# EAGLE design I2C_LCD_MCP23017 (EAGLE 7.4.0)
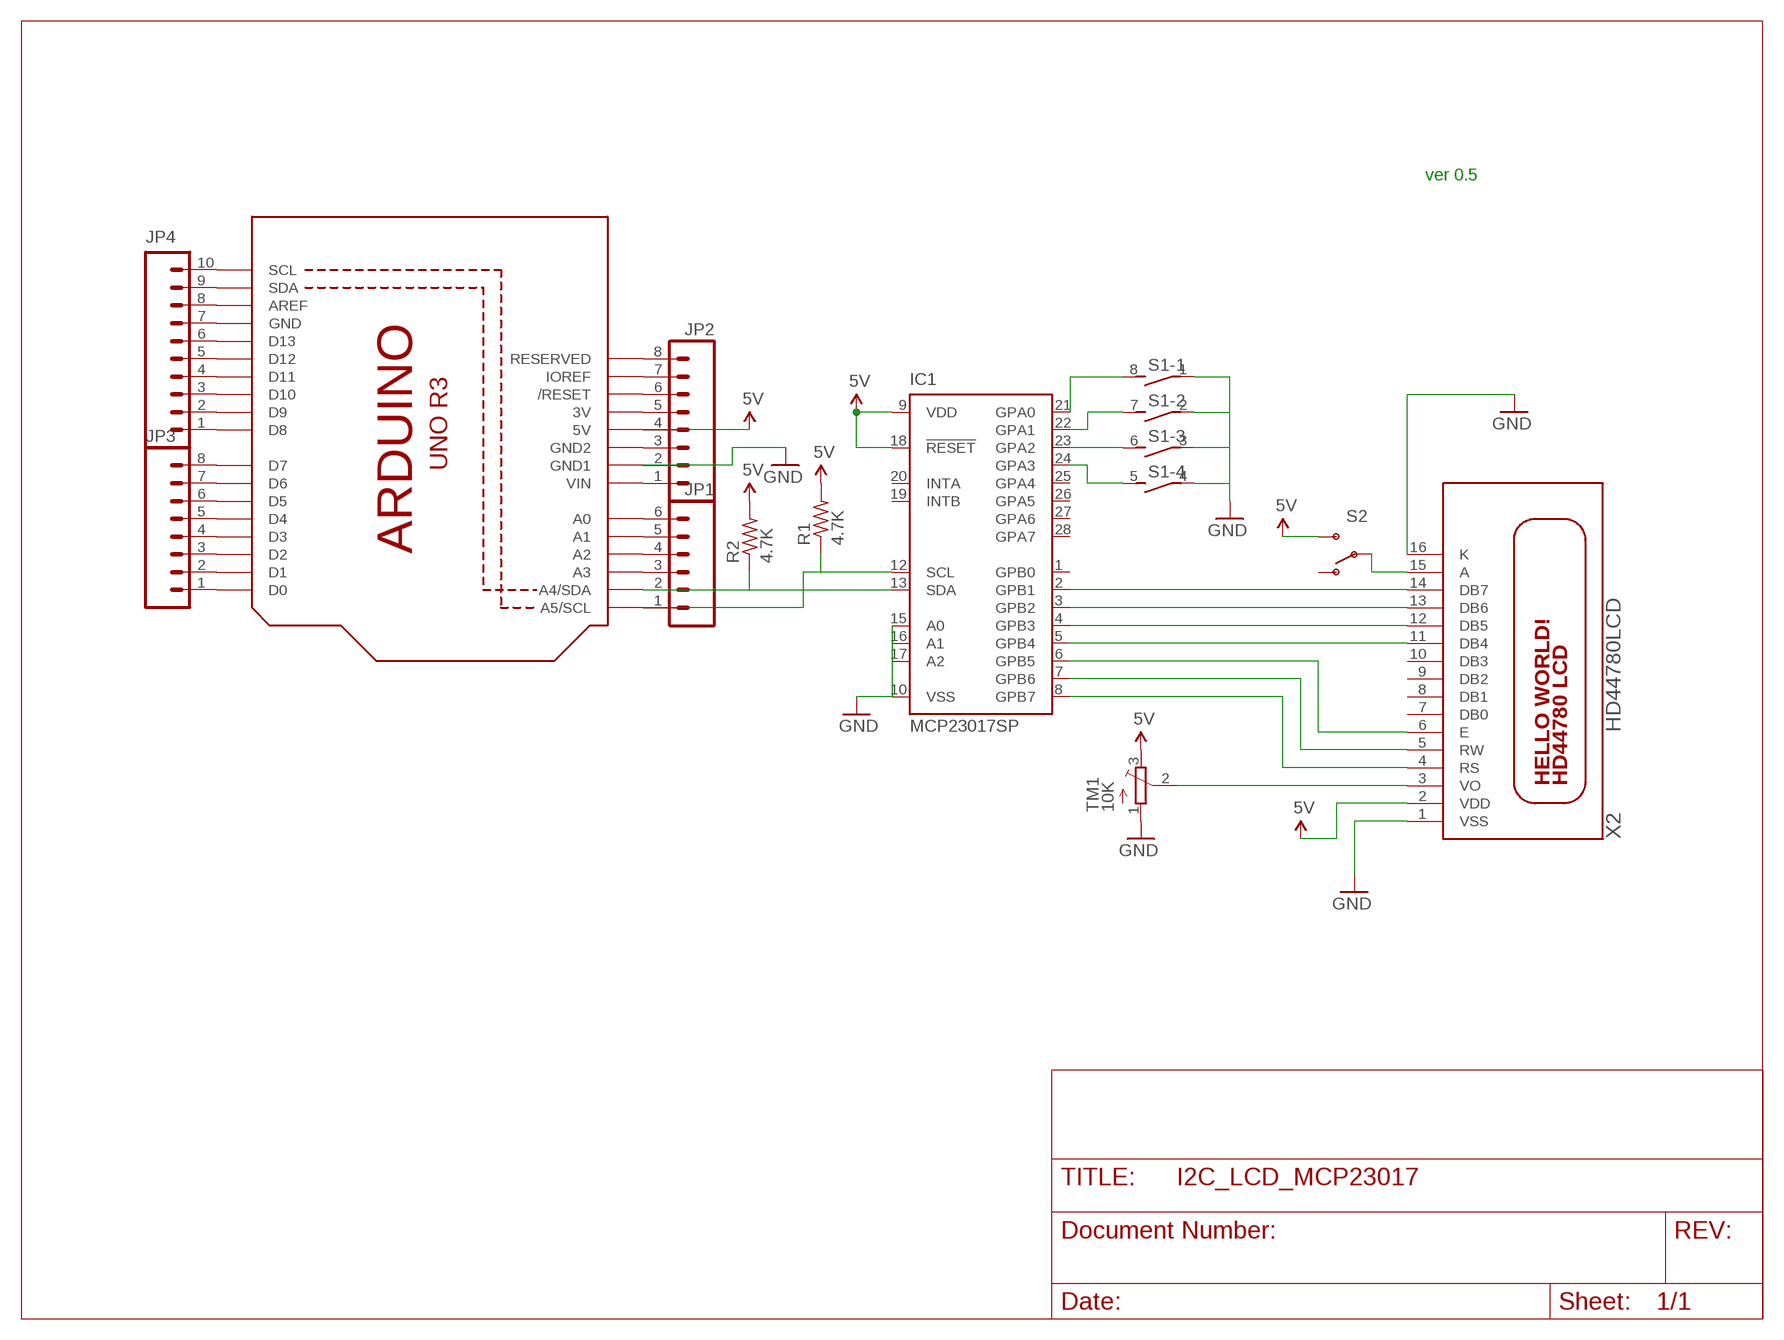
[diagram p0: schematic, sheet 1]

## Parts
IC1  MCP23017SP  [DIL28-3]
JP1  M06LONGPADS  [1X06_LONGPADS]
JP2  M08LONGPADS  [1X08_LONGPADS]
JP3  M08LONGPADS  [1X08_LONGPADS]
JP4  M10LONGPADS  [1X10_LONGPADS]
R1  4.7K  R-US_0207/10  [0207/10]
R2  4.7K  R-US_0207/10  [0207/10]
S1  DIP04S  [DIP04S]
S2  SWITCH-SPDTPTH  [SWITCH-SPDT]
TM1  10K  TRIMPOT  [TRIM-3386U]
U1  ARDUINOR3LONGHEADERATBOTTOM  [ARDUINOR3-BPLACE_TURNED]
X2  HD44780LCD  [LCD_40_04]

## Nets
5V: IC1.9(VDD) IC1.18(!RESET) JP2.4 R1.2 R2.2 S2.3(S) TM1.3(E) U1.5V X2.2(VDD)
GND: IC1.10(VSS) IC1.15(A0) IC1.16(A1) IC1.17(A2) JP2.2 S1.1 S1.2 S1.3 S1.4 TM1.1(A) U1.GND1 X2.1(VSS) X2.16(K)
N$1: JP4.7 U1.GND
N$2: TM1.2(S) X2.3(VO)
N$3: IC1.21(GPA0) S1.8
N$4: IC1.2(GPB1) X2.14(DB7)
N$5: IC1.3(GPB2) X2.13(DB6)
N$6: IC1.4(GPB3) X2.12(DB5)
N$7: IC1.5(GPB4) X2.11(DB4)
N$8: IC1.6(GPB5) X2.6(E)
N$9: IC1.7(GPB6) X2.5(RW)
N$10: IC1.8(GPB7) X2.4(RS)
N$11: IC1.13(SDA) JP1.2 R2.1 U1.A4(A4/SDA)
N$12: IC1.12(SCL) JP1.1 R1.1 U1.A5(A5/SCL)
N$13: JP3.4 U1.D3
N$14: JP1.3 U1.A3
N$15: JP1.4 U1.A2
N$16: JP1.5 U1.A1
N$17: JP1.6 U1.A0
N$18: JP2.1 U1.VIN
N$19: IC1.22(GPA1) S1.7
N$20: JP2.3 U1.GND2
N$21: IC1.23(GPA2) S1.6
N$22: JP2.5 U1.3V
N$23: JP2.6 U1.RESET(/RESET)
N$24: JP2.7 U1.IOREF
N$25: JP2.8 U1.RESERVED
N$26: JP3.1 U1.D0
N$27: JP3.2 U1.D1
N$28: JP3.3 U1.D2
N$29: JP3.5 U1.D4
N$30: JP3.6 U1.D5
N$31: JP3.7 U1.D6
N$32: JP3.8 U1.D7
N$33: JP4.1 U1.D8
N$34: JP4.2 U1.D9
N$35: JP4.3 U1.D10
N$36: JP4.4 U1.D11
N$37: JP4.5 U1.D12
N$38: JP4.6 U1.D13
N$39: IC1.24(GPA3) S1.5
N$40: JP4.8 U1.AREF
N$41: JP4.9 U1.SDA
N$42: JP4.10 U1.SCL
N$43: S2.2(P) X2.15(A)
Unconnected: IC1.1(GPB0) IC1.19(INTB) IC1.20(INTA) IC1.25(GPA4) IC1.26(GPA5) IC1.27(GPA6) IC1.28(GPA7) S2.1(O) X2.7(DB0) X2.8(DB1) X2.9(DB2) X2.10(DB3)

## Notes on the sheet
- ver 0.5

## Library data of the parts
IC1 = adafruit:MCP23017: http://ww1.microchip.com/downloads/en/DeviceDoc/21952a.pdf Source: http://ww1.microchip.com/downloads/en/DeviceDoc/21952a.pdf
JP1 = tmb_connectors:M06: Header 6 Standard 6-pin 0.1" header. Use with straight break away headers (SKU : PRT-00116), right angle break away headers (PRT-00553), swiss pins (PRT-00743), machine pins (PRT-00117), and female headers (PRT-00115). Molex polarized connector foot print use with SKU : PRT-08094 with associated crimp pins and housings. NOTES ON THE VARIANTS LOCK and LOCK_LONGPADS... This footprint was designed to help hold the alignment of a through-hole component (i.e. 6-pin header) while soldering it into place. You may notice that each hole has been shifted either up or down by 0.005 of an inch from it's more standard position (which is a perfectly straight line). This slight alteration caused the pins (the squares in the middle) to touch the edges of the holes. Because they are alternating, it causes a "brace" to hold the component in place. 0.005 has proven to be the perfect amount of "off-center" position when using our standard breakaway headers. Although looks a little odd when you look at the bare footprint, once you have a header in there, the alteration is very hard to notice. Also,if you push a header all the way into place, it is covered up entirely on the bottom side. This idea of altering the position of holes to aid alignment will be further integrated into the Sparkfun Library for other footprints. It can help hold any component with 3 or more connection pins.
JP2 JP3 = tmb_connectors:M08: Header 8 Standard 8-pin 0.1" header. Use with straight break away headers (SKU : PRT-00116), right angle break away headers (PRT-00553), swiss pins (PRT-00743), machine pins (PRT-00117), and female headers (PRT-00115).
JP4 = tmb_connectors:M10: Header 10 Standard 10-pin 0.1" header. Use with straight break away headers (SKU : PRT-00116), right angle break away headers (PRT-00553), swiss pins (PRT-00743), machine pins (PRT-00117), and female headers (PRT-00115).
R1 R2 = adafruit:R-US_: RESISTOR, American symbol
S1 = switch-dil:DIP04S: DIL/CODE SWITCH; OC_FARNELL: unknown; OC_NEWARK: unknown
S2 = SparkFun-Electromechanical:SWITCH-SPDT: SPDT Switch Simple slide switch, Spark Fun Electronics SKU : COM-00102 DPDT SMT slide switch, AYZ0202, SWCH-08179; PROD_ID: SWCH-08261
TM1 = tmb_trimpot:TRIMPOT: SMT trimmer potentiometer part number TC33X
U1 = tmb_boards:ARDUINOR3: This is a new object for the new Arduino R3 - with extra pins that you may want to use (such as IOref, and duplicated A4/A5
X2 = tmb_display:HD44780LCD: HD44780 LCD Standard character type LCDs, available in sizes from 8x1 to 40x4!

## Board
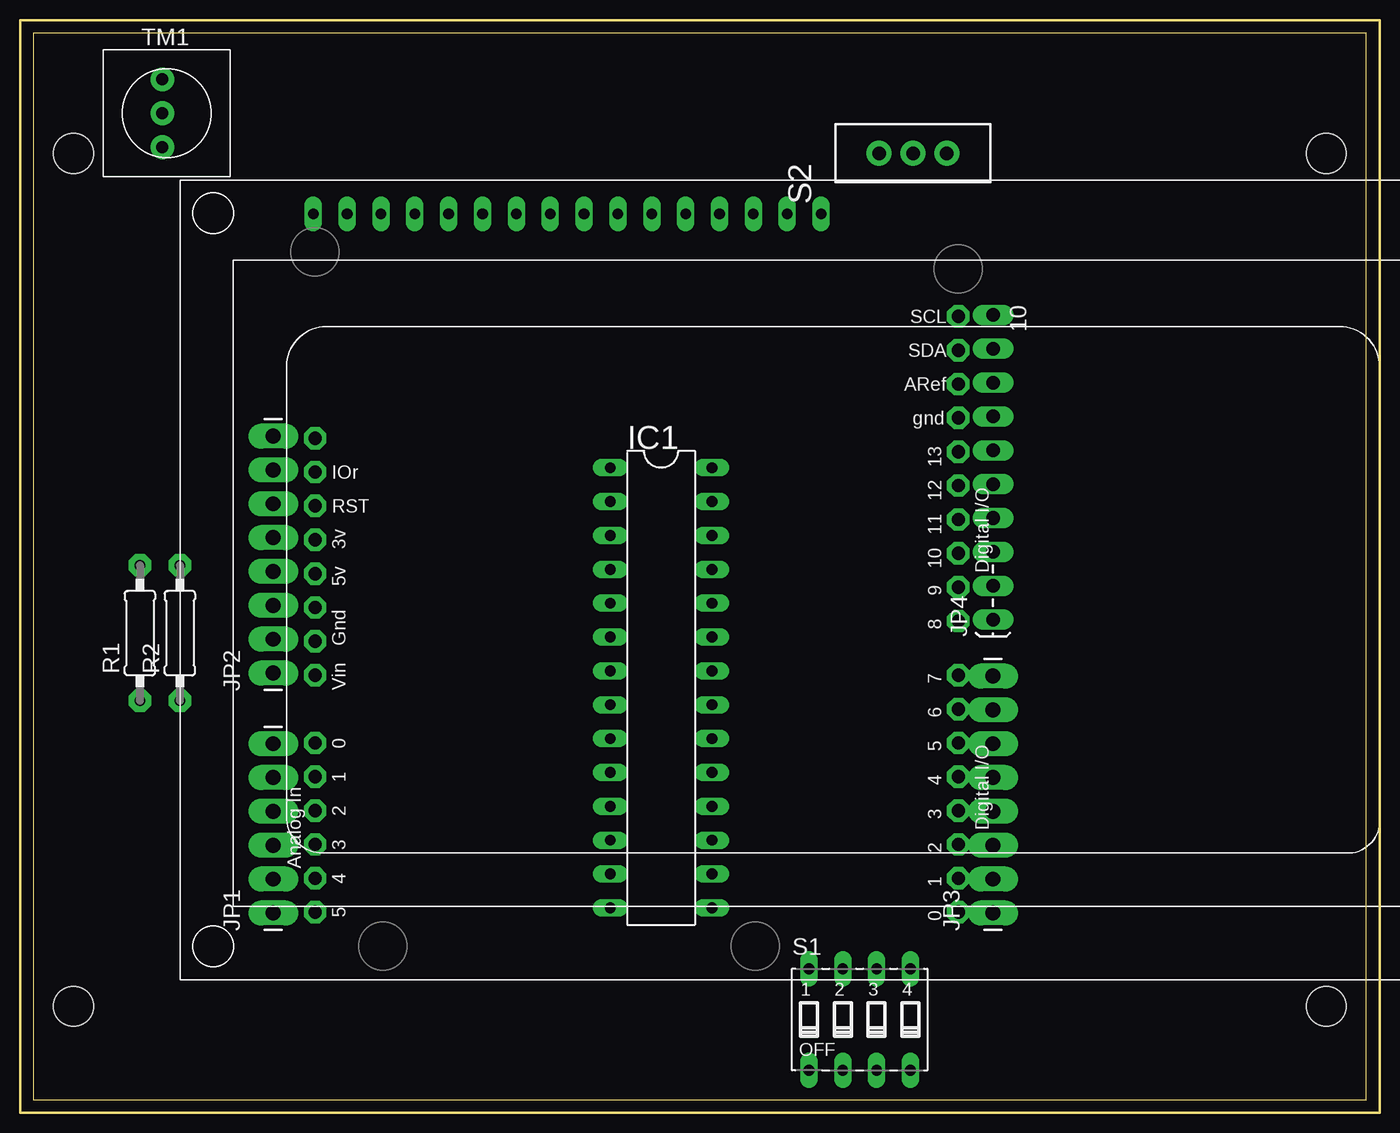
[diagram p1: board, top side]
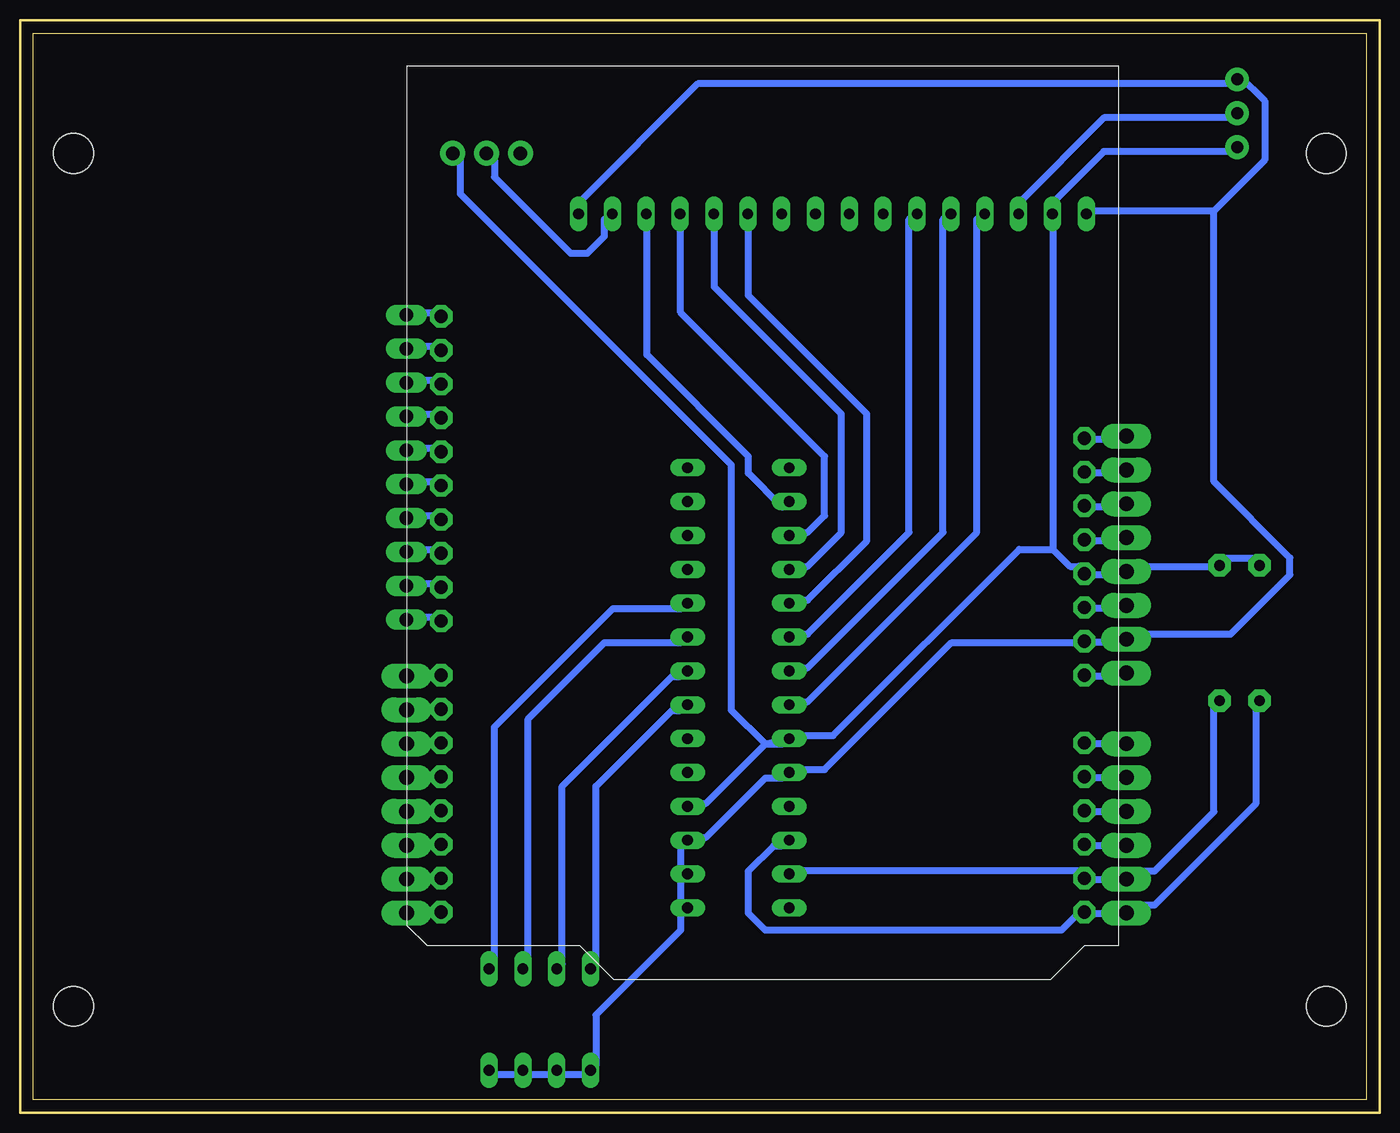
[diagram p2: board, bottom side, seen from below]

Size 100 x 80 mm. Coordinates in mm from the lower left corner, seen from the top.
Outline: 0,0 100,0 100,80 0,80 0,0
Copper layers (1*16): Top 0.035mm / dielectric 1.5mm / Bottom 0.035mm
Design rules "PCBMilling *": minimum track width 20mil, minimum drill 24mil, track to track 30mil, track to pad 20mil, pad to pad 8mil, via to via 8mil, smd to smd 8mil, copper to edge 40mil, drill to drill 8mil, minimum pad ring 10mil, minimum via ring 8mil, stop-mask expansion 4mil, vias tented up to drill 0mil, thermal gap 10mil
Holes 3 mm at 3,7 3,71 97,7 97,71
Milling: 4 lines

### Footprints (pad centres in the part's own frame; a part is rotated, then mirrored left to right if it is on the bottom)
DIL28-3 = drill 0.813 long: 1 -16.51,-3.81; 2 -13.97,-3.81; 3 -11.43,-3.81; 4 -8.89,-3.81; 5 -6.35,-3.81; 6 -3.81,-3.81; 7 -1.27,-3.81; 8 1.27,-3.81; 9 3.81,-3.81; 10 6.35,-3.81; 11 8.89,-3.81; 12 11.43,-3.81; 13 13.97,-3.81; 14 16.51,-3.81; 15 16.51,3.81; 16 13.97,3.81; 17 11.43,3.81; 18 8.89,3.81; 19 6.35,3.81; 20 3.81,3.81; 21 1.27,3.81; 22 -1.27,3.81; 23 -3.81,3.81; 24 -6.35,3.81; 25 -8.89,3.81; 26 -11.43,3.81; 27 -13.97,3.81; 28 -16.51,3.81
1X06_LONGPADS = drill 1.118 pad 1.88 long: 1 0,0; 2 2.54,0; 3 5.08,0; 4 7.62,0; 5 10.16,0; 6 12.7,0
1X08_LONGPADS = drill 1.118 pad 1.88 long: 1 0,0; 2 2.54,0; 3 5.08,0; 4 7.62,0; 5 10.16,0; 6 12.7,0; 7 15.24,0; 8 17.78,0
1X10_LONGPADS = drill 1.016 long: 1 0.01,-0.003; 2 2.55,-0.003; 3 5.09,-0.003; 4 7.63,-0.003; 5 10.17,-0.003; 6 12.71,-0.003; 7 15.25,-0.003; 8 17.79,-0.003; 9 20.33,-0.003; 10 22.87,-0.003
0207/10 = drill 0.813 pad 1.676 octagon: 1 -5.08,0; 2 5.08,0
DIP04S = drill 0.813 long: 1 -3.81,-3.81; 2 -1.27,-3.81; 3 1.27,-3.81; 4 3.81,-3.81; 5 3.81,3.81; 6 1.27,3.81; 7 -1.27,3.81; 8 -3.81,3.81
SWITCH-SPDT = drill 1.016 pad 1.88: 1 0,2.54; 2 0,0; 3 0,-2.54
TRIM-3386U = drill 0.9 pad 1.778: 1 -2.54,-0.318; 2 0,-0.318; 3 2.54,-0.318
ARDUINOR3-BPLACE_TURNED = drill 1 pad 1.676 octagon: 3V 0,22.86; 5V -2.54,22.86; A0 -15.24,22.86; A1 -17.78,22.86; A2 -20.32,22.86; A3 -22.86,22.86; A4 -25.4,22.86; A5 -27.94,22.86; AREF 11.684,-25.4; D0 -27.94,-25.4; D1 -25.4,-25.4; D2 -22.86,-25.4; D3 -20.32,-25.4; D4 -17.78,-25.4; D5 -15.24,-25.4; D6 -12.7,-25.4; D7 -10.16,-25.4; D8 -6.096,-25.4; D9 -3.556,-25.4; D10 -1.016,-25.4; D11 1.524,-25.4; D12 4.064,-25.4; D13 6.604,-25.4; GND 9.144,-25.4; GND1 -7.62,22.86; GND2 -5.08,22.86; IOREF 5.08,22.86; RESERVED 7.62,22.86; RESET 2.54,22.86; SCL 16.764,-25.4; SDA 14.224,-25.4; VIN -10.16,22.86
LCD_40_04 = drill 0.8 long: 1 10,57.46; 2 12.54,57.46; 3 15.08,57.46; 4 17.62,57.46; 5 20.16,57.46; 6 22.7,57.46; 7 25.24,57.46; 8 27.78,57.46; 9 30.32,57.46; 10 32.86,57.46; 11 35.4,57.46; 12 37.94,57.46; 13 40.48,57.46; 14 43.02,57.46; 15 45.56,57.46; 16 48.1,57.46

### Placement (x,y rotation side)
IC1  47.1,30.89 270 top
JP1  18,14 90 top
JP2  18,32 90 top
JP3  72,14 90 top
JP4  72,36 90 top
R1  8,35 90 top
R2  11,35 90 top
S1  62,6 0 top
S2  66,71 90 top
TM1  10,74 270 top
U1  44,42 90 top
X2  11,9 0 top

### Tracks (layer width: path | path; a pad name or v marks a point on that pad's centre or on a via)
5V
  Bottom 0.508: R1.2 8.26,40.64 10.79,40.64 R2.2 11.43,40.01 17.78,40.01 JP2.4 18.41,39.37 20.95,39.37 U1.5V 21.59,40.01 22.23,40.01 23.5,41.27 | TM1.3 10.16,71.12 19.68,71.12 23.5,67.31 23.5,66.67 X2.2 23.5,66.04 23.5,41.27 | 45.09,26.67 43.81,26.67 IC1.9 | 45.09,26.67 49.53,22.23 50.8,22.23 IC1.18 | 45.09,26.67 47.62,29.21 47.62,47.62 67.94,67.94 67.94,70.48 S2.3 | 45.09,26.67 IC1.9 | 23.5,41.27 26.04,41.27 40.01,27.3 43.18,27.3 IC1.9
GND
  Bottom 0.508: 11.43,66.67 20.95,66.67 X2.1 | 11.43,66.67 7.62,70.48 7.62,74.93 9.53,76.83 TM1.1 10.16,76.2 50.16,76.2 59.05,67.31 59.05,66.67 X2.16 | S1.4 65.41,1.91 63.5,1.91 S1.3 62.87,1.91 60.96,1.91 S1.2 60.33,1.91 58.42,1.91 S1.1 57.78,2.54 57.78,6.35 51.44,12.7 51.44,13.97 IC1.15 51.44,14.61 51.44,16.51 IC1.16 51.44,17.14 51.44,19.05 IC1.17 50.8,19.68 49.53,19.68 45.09,24.13 43.81,24.13 IC1.10 43.18,24.77 40.64,24.77 31.11,34.29 21.59,34.29 U1.GND1 20.95,34.29 18.41,34.29 JP2.2 17.78,34.92 10.16,34.92 5.71,39.37 5.71,40.64 11.43,46.35 11.43,66.67
N$1
  Bottom 0.508: U1.GND 69.85,51.44 71.75,51.44 JP4.7
N$2
  Bottom 0.508: X2.3 26.04,66.67 26.04,67.31 19.68,73.66 10.16,73.66 TM1.2
N$3
  Bottom 0.508: IC1.21 51.44,29.21 52.07,29.21 57.78,23.5 57.78,10.16 S1.8
N$4
  Bottom 0.508: X2.14 53.98,66.04 53.98,55.88 46.35,48.26 46.35,46.99 43.81,44.45 IC1.2
N$5
  Bottom 0.508: X2.13 51.44,66.04 51.44,59.05 40.64,48.26 40.64,43.81 41.91,42.55 43.18,42.55 IC1.3
N$6
  Bottom 0.508: X2.12 48.9,66.04 48.9,60.96 39.37,51.44 39.37,42.55 41.91,40.01 43.18,40.01 IC1.4
N$7
  Bottom 0.508: X2.11 46.35,66.04 46.35,60.33 37.47,51.44 37.47,41.91 41.91,37.47 43.18,37.47 IC1.5
N$8
  Bottom 0.508: X2.6 34.29,66.04 34.29,42.55 41.91,34.92 43.18,34.92 IC1.6
N$9
  Bottom 0.508: X2.5 31.75,66.04 31.75,42.55 41.91,32.38 43.18,32.38 IC1.7
N$10
  Bottom 0.508: X2.4 29.21,66.04 29.21,42.55 41.91,29.84 43.18,29.84 IC1.8
N$11
  Bottom 0.508: R2.1 11.43,29.84 11.43,21.59 15.88,17.14 17.78,17.14 JP1.2 18.41,16.51 20.95,16.51 U1.A4 21.59,17.14 43.18,17.14 IC1.13
N$12
  Bottom 0.508: R1.1 8.26,29.84 8.26,22.23 15.88,14.61 17.78,14.61 JP1.1 18.41,13.97 20.95,13.97 U1.A5 21.59,13.97 22.86,12.7 45.09,12.7 46.35,13.97 46.35,17.14 44.45,19.05 43.81,19.05 IC1.12
N$13
  Bottom 0.508: U1.D3 69.85,21.59 71.75,21.59 JP3.4
N$14
  Bottom 0.508: U1.A3 20.95,19.05 18.41,19.05 JP1.3
N$15
  Bottom 0.508: U1.A2 20.95,21.59 18.41,21.59 JP1.4
N$16
  Bottom 0.508: U1.A1 20.95,24.13 18.41,24.13 JP1.5
N$17
  Bottom 0.508: U1.A0 20.95,26.67 18.41,26.67 JP1.6
N$18
  Bottom 0.508: U1.VIN 20.95,31.75 18.41,31.75 JP2.1
N$19
  Bottom 0.508: IC1.22 51.44,31.75 52.07,31.75 60.33,23.5 60.33,10.16 S1.7
N$20
  Bottom 0.508: U1.GND2 20.95,36.83 18.41,36.83 JP2.3
N$21
  Bottom 0.508: IC1.23 51.44,34.29 57.15,34.29 62.87,28.57 62.87,10.16 S1.6
N$22
  Bottom 0.508: U1.3V 20.95,41.91 18.41,41.91 JP2.5
N$23
  Bottom 0.508: U1.RESET 20.95,44.45 18.41,44.45 JP2.6
N$24
  Bottom 0.508: U1.IOREF 20.95,46.99 18.41,46.99 JP2.7
N$25
  Bottom 0.508: U1.RESERVED 20.95,49.53 18.41,49.53 JP2.8
N$26
  Bottom 0.508: U1.D0 69.85,13.97 71.75,13.97 JP3.1
N$27
  Bottom 0.508: U1.D1 69.85,16.51 71.75,16.51 JP3.2
N$28
  Bottom 0.508: U1.D2 69.85,19.05 71.75,19.05 JP3.3
N$29
  Bottom 0.508: U1.D4 69.85,24.13 71.75,24.13 JP3.5
N$30
  Bottom 0.508: U1.D5 69.85,26.67 71.75,26.67 JP3.6
N$31
  Bottom 0.508: U1.D6 69.85,29.21 71.75,29.21 JP3.7
N$32
  Bottom 0.508: U1.D7 69.85,31.75 71.75,31.75 JP3.8
N$33
  Bottom 0.508: U1.D8 69.85,36.2 71.75,36.2 JP4.1
N$34
  Bottom 0.508: U1.D9 69.85,38.73 71.75,38.73 JP4.2
N$35
  Bottom 0.508: U1.D10 69.85,41.27 71.75,41.27 JP4.3
N$36
  Bottom 0.508: U1.D11 69.85,43.81 71.75,43.81 JP4.4
N$37
  Bottom 0.508: U1.D12 69.85,46.35 71.75,46.35 JP4.5
N$38
  Bottom 0.508: U1.D13 69.85,48.9 71.75,48.9 JP4.6
N$39
  Bottom 0.508: IC1.24 51.44,36.83 56.52,36.83 65.41,27.94 65.41,10.16 S1.5
N$40
  Bottom 0.508: U1.AREF 69.85,53.98 71.75,53.98 JP4.8
N$41
  Bottom 0.508: U1.SDA 69.85,56.52 71.75,56.52 JP4.9
N$42
  Bottom 0.508: U1.SCL 69.85,59.05 71.75,59.05 JP4.10
N$43
  Bottom 0.508: X2.15 57.15,66.04 57.15,64.77 58.42,63.5 59.69,63.5 65.41,69.22 65.41,70.48 S2.2